# Altium project Actuator Controller.PrjPcb
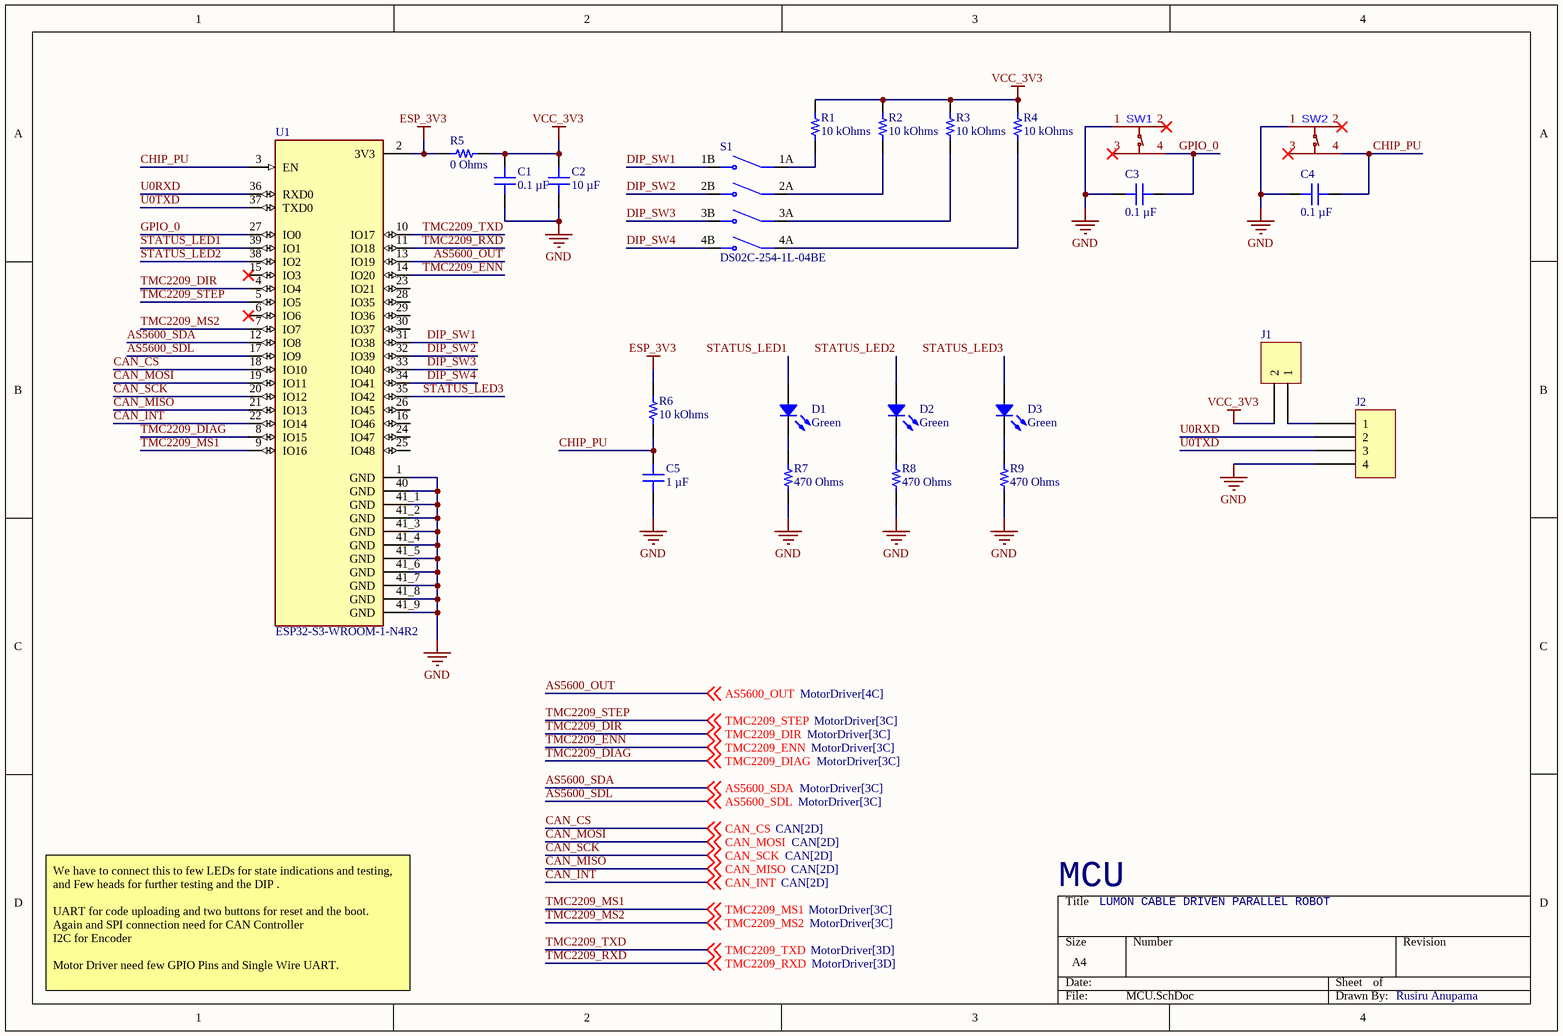
[diagram p0: MCU.SchDoc]
4 sheets, 63 parts. Net scope: global (net labels, ports and power ports of the same name join across sheets).
Board file: AcutuatorPCB.PcbDoc
Sheets:
  MCU.SchDoc
  Power.SchDoc
  MotorDriver.SchDoc
  CAN.SchDoc

## Sheet MCU.SchDoc
size A4; SheetNumber: 1; SheetTotal: 4

### Parts
C1  0.1 µF  [CAP 0805_2012]
C2  10 µF  [CAP 0805_2012]
C3  0.1 µF  [CAP 0805_2012]
C4  0.1 µF  [CAP 0805_2012]
C5  1 µF  [CAP 0805_2012]
D1  Green  [LED 0805_2012 GREEN]
D2  Green  [LED 0805_2012 GREEN]
D3  Green  [LED 0805_2012 GREEN]
J1  0022272021  [MOLEX KK 0022272021]  (value not drawn)
J2  0022272041  [MOLEX KK 0022272041]  (value not drawn)
R1  10 kOhms  [RES 0805_2012]
R2  10 kOhms  [RES 0805_2012]
R3  10 kOhms  [RES 0805_2012]
R4  10 kOhms  [RES 0805_2012]
R5  0 Ohms  [RES 0805_2012]
R6  10 kOhms  [RES 0805_2012]
R7  470 Ohms  [RES 0805_2012]
R8  470 Ohms  [RES 0805_2012]
R9  470 Ohms  [RES 0805_2012]
S1  DS02C-254-1L-04BE  [SW_DS02C-254-1L-04BE]
SW1  4.5X4.5X5.0WATERPROOF TACT SWITCH DIP 260G  [SW-TH_4P-L4.5-W4.5-P3.00-LS5.5]  (value not drawn)
SW2  4.5X4.5X5.0WATERPROOF TACT SWITCH DIP 260G  [SW-TH_4P-L4.5-W4.5-P3.00-LS5.5]  (value not drawn)
U1  ESP32-S3-WROOM-1-N4R2  [XCVR_ESP32-S3-WROOM-1-N4R2]

### Nets
ESP_3V3: R5.1 R6.2 U1.2(3V3)
GND: C1.1 C2.1 C3.1 C4.1 C5.1 J2.4 R7.1 R8.1 R9.1 SW1.1(A) SW2.1(A) U1.1(GND) U1.40(GND) U1.41_1(GND) U1.41_2(GND) U1.41_3(GND) U1.41_4(GND) U1.41_5(GND) U1.41_6(GND) U1.41_7(GND) U1.41_8(GND) U1.41_9(GND)
VCC_3V3: C1.2 C2.2 J1.2 R1.2 R2.2 R3.2 R4.2 R5.2
AS5600_OUT: U1.13(IO19) ; off-sheet AS5600_OUT
AS5600_SDA: U1.12(IO8) ; off-sheet AS5600_SDA
AS5600_SDL: U1.17(IO9) ; off-sheet AS5600_SDL
CAN_CS: U1.18(IO10) ; off-sheet CAN_CS
CAN_INT: U1.22(IO14) ; off-sheet CAN_INT
CAN_MISO: U1.21(IO13) ; off-sheet CAN_MISO
CAN_MOSI: U1.19(IO11) ; off-sheet CAN_MOSI
CAN_SCK: U1.20(IO12) ; off-sheet CAN_SCK
CHIP_PU: C4.2 C5.2 R6.1 SW2.4(D) U1.3(EN)
DIP_SW1: S1.1B(NO1) U1.31(IO38)
DIP_SW2: S1.2B(NO2) U1.32(IO39)
DIP_SW3: S1.3B(NO3) U1.33(IO40)
DIP_SW4: S1.4B(NO4) U1.34(IO41)
GPIO_0: C3.2 SW1.4(D) U1.27(IO0)
STATUS_LED1: D1.1 U1.39(IO1)
STATUS_LED2: D2.1 U1.38(IO2)
STATUS_LED3: D3.1 U1.35(IO42)
TMC2209_DIAG: U1.8(IO15) ; off-sheet TMC2209_DIAG
TMC2209_DIR: U1.4(IO4) ; off-sheet TMC2209_DIR
TMC2209_ENN: U1.14(IO20) ; off-sheet TMC2209_ENN
TMC2209_MS1: U1.9(IO16) ; off-sheet TMC2209_MS1
TMC2209_MS2: U1.7(IO7) ; off-sheet TMC2209_MS2
TMC2209_RXD: U1.11(IO18) ; off-sheet TMC2209_RXD  [project net PD_UART]
TMC2209_STEP: U1.5(IO5) ; off-sheet TMC2209_STEP
TMC2209_TXD: U1.10(IO17) ; off-sheet TMC2209_TXD
U0RXD: J2.2 U1.36(RXD0)
U0TXD: J2.3 U1.37(TXD0)
NetD1_2: D1.2 R7.2
NetD2_2: D2.2 R8.2
NetD3_2: D3.2 R9.2
NetJ1_1: J1.1 J2.1
NetR1_1: R1.1 S1.1A(COM1)
NetR2_1: R2.1 S1.2A(COM2)
NetR3_1: R3.1 S1.3A(COM3)
NetR4_1: R4.1 S1.4A(COM4)

Not connected (* = marked no-connect by the designer): SW1 2(B)* 3(C)*; SW2 2(B)* 3(C)*; U1 6(IO6)* 15(IO3)* 16(IO46) 23(IO21) 24(IO47) 25(IO48) 26(IO45) 28(IO35) 29(IO36) 30(IO37)

### Notes on the sheet
- MCU
- LUMON CABLE DRIVEN PARALLEL ROBOT
- We have to connect this to few LEDs for state indications and testing, and Few heads for further testing and the DIP .
  UART for code uploading and two buttons for reset and the boot.
  Again and SPI connection need for CAN Controller
  I2C for Encoder
  Motor Driver need few GPIO Pins and Single Wire UART.
- Rusiru Anupama

### Library data of the parts
C1 C3 C4 = CC0805MRX7R9BB104: CAP CER 0.1UF 50V X7R 0805; manufacturer: Yageo; Tolerance: ±20%; Part Number: CC0805MRX7R9BB104; Capacitance: 0.1 µF; Applications: General Purpose; componentlink1description: Datasheet; componentlink1url: https://www.yageo.com/upload/media/product/productsearch/datasheet/mlcc/UPY-GPHC_X7R_6.3V-to-50V_18.pdf; componentlink2description: DigiKey Link; componentlink2url: https://www.digikey.com/en/products/detail/yageo/CC0805MRX7R9BB104/5884281; Device Package: 0805 (2012 Metric); lastupdated: 4/6/2026 7:33:19 PM; Lifecycle Status: Active; Minimum Order: 1; Mounting Type: Surface Mount, MLCC; Operating Temperature: -55°C ~ 125°C; Package / Case: 0805 (2012 Metric); packaging: TapeAndReel; partid: 2475; Part Status: Active; price: 0.01; series: CC; Size / Dimension: 0.079" L x 0.049" W (2.00mm x 1.25mm); Supplier 1: DigiKey; Supplier Part Number 1: 311-4351-1-ND; Temperature Coefficient: X7R; Thickness (Max): 0.037" (0.95mm); value: 0.1 µF; Voltage - Rated: 50V; LCSC part #: C49678
  C1 C3: Parameter 1: *
C2 = CL21Y106KPQVPNE: CAP CER 10UF 10V X7S 0805; manufacturer: Samsung Electro-Mechanics; Tolerance: ±10%; Part Number: CL21Y106KPQVPNE; Capacitance: 10 µF; Applications: Automotive; componentlink1description: Datasheet; componentlink1url: http://www.samsungsem.com/kr/support/product-search/mlcc/CL21Y106KPQVPNE.jsp; componentlink2description: DigiKey Link; componentlink2url: https://www.digikey.com/en/products/detail/samsung-electro-mechanics/CL21Y106KPQVPNE/5961169; Device Package: 0805 (2012 Metric); Features: General Purpose; lastupdated: 4/6/2026 7:33:17 PM; Lifecycle Status: Active; Minimum Order: 1; Mounting Type: Surface Mount, MLCC, Epoxy; Operating Temperature: -55°C ~ 125°C; Package / Case: 0805 (2012 Metric); packaging: TapeAndReel; partid: 2979; Part Status: Active; price: 0.06; Ratings: AEC-Q200; series: CL; Size / Dimension: 0.079" L x 0.049" W (2.00mm x 1.25mm); Supplier 1: DigiKey; Supplier Part Number 1: 1276-6685-1-ND; Temperature Coefficient: X7S; Thickness (Max): 0.055" (1.40mm); value: 10 µF; Voltage - Rated: 10V; LCSC part #: C32635
C5 = C2012X8R1C105K125AB: CAP CER 1UF 16V X8R 0805; manufacturer: TDK Corporation; Tolerance: ±10%; Part Number: C2012X8R1C105K125AB; Capacitance: 1 µF; Applications: General Purpose; componentlink1description: Datasheet; componentlink1url: https://product.tdk.com/info/en/catalog/datasheets/mlcc_commercial_hightemp_en.pdf?ref_disty=digikey; componentlink2description: DigiKey Link; componentlink2url: https://www.digikey.com/en/products/detail/tdk-corporation/C2012X8R1C105K125AB/3248171; Device Package: 0805 (2012 Metric); Features: High Temperature; lastupdated: 4/6/2026 7:33:17 PM; Lifecycle Status: Active; Minimum Order: 1; Mounting Type: Surface Mount, MLCC; Operating Temperature: -55°C ~ 150°C; Package / Case: 0805 (2012 Metric); packaging: TapeAndReel; partid: 2997; Part Status: Active; price: 0.07; series: C; Size / Dimension: 0.079" L x 0.049" W (2.00mm x 1.25mm); Supplier 1: DigiKey; Supplier Part Number 1: 445-8829-1-ND; Temperature Coefficient: X8R; Thickness (Max): 0.057" (1.45mm); value: 1 µF; Voltage - Rated: 16V; LCSC part #: C24123
D1-D3 = 5975316507F: LED GREEN 0805 SMD; Manufacturer: Dialight; Configuration: Standard; Current - Test: 20mA; Lens Color: 0.93mm; Lens Size: 1.40mm x 1.24mm; Lens Style: Rectangle with Flat Top; Millicandela Rating: 16mcd; Voltage - Forward (Vf) (Typ): 2.2V; Wavelength - Dominant: 560nm; Part Number: 5975316507F; Color: Green; ComponentLink1Description: Datasheet; ComponentLink1URL: http://www.dialightsignalsandcomponents.com/Assets/Drawings/2D_Drawings_DrawingDetailedSpec/NewDrawings/18370A.pdf; ComponentLink2Description: DigiKey Link; ComponentLink2URL: https://www.digikey.com/en/products/detail/dialight/5975316507F/9385444; Device Package: 0805 (2012 Metric); Height (Max): 0.93mm; LastUpdated: 4/5/2026 8:39:04 PM; Lifecycle Status: Active; Minimum Order: 1; Mounting Type: Surface Mount; Package / Case: 0805 (2012 Metric); Packaging: TapeAndReel; PartId: 245; Part Status: Active; Price: 0.14; Series: 597; Size / Dimension: 2.00mm L x 1.25mm W; Supplier 1: DigiKey; Supplier Part Number 1: 350-4389-1-ND; Supplier Device Package: 0805; Value: Green; LCSC part #: C84260
J1 = 0022272021: CONN HEADER VERT 2POS 2.54MM; Manufacturer: Molex; Contact Length - Mating: 0.295" (7.49mm); Contact Length - Post: 0.140" (3.56mm); Material Flammability Rating: UL94 V-0; Number of Positions: 2; Number of Positions Loaded: All; Overall Contact Length: 0.560" (14.22mm); Pitch - Mating: 0.100" (2.54mm); Shrouding: Shrouded - 1 Wall; Style: Board to Cable/Wire; Part Number: 0022272021; ComponentLink1Description: Datasheet; ComponentLink1URL: https://www.molex.com/pdm_docs/sd/022272021_sd.pdf; ComponentLink2Description: DigiKey Link; ComponentLink2URL: http://digikey.com/product-detail/en/molex/0022272021/WM4111-ND/1130577; Connector Type: Header; Contact Finish - Mating: Tin; Contact Finish - Post: Tin; Contact Finish Thickness - Mating: 100.0µin (2.54µm); Contact Material: Brass; Contact Shape: Square; Contact Type: Male Pin; Fastening Type: Friction Lock; Insulation Color: Natural; Insulation Height: 0.461" (11.70mm); Insulation Material: Polyamide (PA), Nylon; LastUpdated: 1/12/2020 11:51:43 PM; Lifecycle Status: Active; Minimum Order: 1; Mounting Type: Through Hole; Number of Rows: 1; Packaging: Bulk; PartId: 76; Part Status: Active; Price: 0.27; Series: KK 6410; Supplier 1: DigiKey; Supplier Part Number 1: WM4111-ND; Termination: Solder
J2 = 0022272041: CONN HEADER VERT 4POS 2.54MM; Manufacturer: Molex; Contact Length - Mating: 0.295" (7.49mm); Contact Length - Post: 0.140" (3.56mm); Material Flammability Rating: UL94 V-0; Number of Positions: 4; Number of Positions Loaded: All; Overall Contact Length: 0.560" (14.22mm); Pitch - Mating: 0.100" (2.54mm); Shrouding: Shrouded - 1 Wall; Style: Board to Cable/Wire; Part Number: 0022272041; ComponentLink1Description: Datasheet; ComponentLink1URL: https://www.molex.com/pdm_docs/sd/022272041_sd.pdf; ComponentLink2Description: DigiKey Link; ComponentLink2URL: http://digikey.com/product-detail/en/molex/0022272041/WM4113-ND/1130579; Connector Type: Header; Contact Finish - Mating: Tin; Contact Finish - Post: Tin; Contact Finish Thickness - Mating: 100.0µin (2.54µm); Contact Material: Brass; Contact Shape: Square; Contact Type: Male Pin; Fastening Type: Friction Lock; Insulation Color: Natural; Insulation Height: 0.461" (11.70mm); Insulation Material: Polyamide (PA), Nylon; LastUpdated: 1/12/2020 11:52:05 PM; Lifecycle Status: Active; Minimum Order: 1; Mounting Type: Through Hole; Number of Rows: 1; Packaging: Bulk; PartId: 78; Part Status: Active; Price: 0.40; Series: KK 6410; Supplier 1: DigiKey; Supplier Part Number 1: WM4113-ND; Termination: Solder
R1-R4 R6 = CPF0805B10KE: RES SMD 10K OHM 0.1% 1/10W 0805; Manufacturer: TE Connectivity Passive Product; Power (Watts): 0.1W, 1/10W; Temperature Coefficient: ±25ppm/°C; Part Number: CPF0805B10KE; Value: 10 kOhms; ComponentLink1Description: Datasheet; ComponentLink1URL: https://www.te.com/commerce/DocumentDelivery/DDEController?Action=srchrtrv&DocNm=1773200&DocType=DS&DocLang=English; ComponentLink2Description: DigiKey Link; ComponentLink2URL: https://www.digikey.com/en/products/detail/te-connectivity-passive-product/CPF0805B10KE/2389790; Composition: Thin Film; Device Package: 0805 (2012 Metric); Height - Seated (Max): 0.026" (0.65mm); LastUpdated: 4/5/2026 8:11:26 PM; Lifecycle Status: Active; Minimum Order: 1; Number of Terminations: 2; Operating Temperature: -55°C ~ 155°C; Package / Case: 0805 (2012 Metric); Packaging: TapeAndReel; PartId: 27724; Part Status: Active; Price: 0.09; Resistance: 10 kOhms; Series: CPF, Neohm; Size / Dimension: 0.079" L x 0.049" W (2.00mm x 1.25mm); Supplier 1: DigiKey; Supplier Part Number 1: A106043CT-ND; Supplier Device Package: 0805; Tolerance: ±0.1%; LCSC part #: C84376
R5 = TLRZ2ATTD: RES 0 OHM JUMPER 0805; Manufacturer: KOA Speer Electronics, Inc.; Part Number: TLRZ2ATTD; Value: 0 Ohms; ComponentLink1Description: Datasheet; ComponentLink1URL: http://www.koaspeer.com/catimages/Products/TLRZ/TLRZ.pdf; ComponentLink2Description: DigiKey Link; ComponentLink2URL: https://www.digikey.com/en/products/detail/koa-speer-electronics-inc/TLRZ2ATTD/9845494; Composition: Metal Element; Device Package: 0805 (2012 Metric); Features: Automotive AEC-Q200, Current Sense; Height - Seated (Max): 0.022" (0.55mm); LastUpdated: 4/5/2026 8:11:26 PM; Lifecycle Status: Active; Minimum Order: 1; Number of Terminations: 2; Operating Temperature: -65°C ~ 170°C; Package / Case: 0805 (2012 Metric); Packaging: TapeAndReel; PartId: 27685; Part Status: Active; Price: 0.08; Ratings: AEC-Q200; Resistance: 0 Ohms; Series: TLRZ; Size / Dimension: 0.079" L x 0.049" W (2.00mm x 1.25mm); Supplier 1: DigiKey; Supplier Part Number 1: 2019-TLRZ2ATTDCT-ND; Supplier Device Package: 0805; Tolerance: Jumper
R7-R9 = ERJ-PB6B4700V: RES SMD 470 OHM 0.1% 1/4W 0805; Manufacturer: Panasonic Electronic Components; Power (Watts): 0.25W, 1/4W; Temperature Coefficient: ±50ppm/°C; Part Number: ERJ-PB6B4700V; Value: 470 Ohms; ComponentLink1Description: Datasheet; ComponentLink1URL: https://industrial.panasonic.com/cdbs/www-data/pdf/RDM0000/AOA0000C328.pdf; ComponentLink2Description: DigiKey Link; ComponentLink2URL: https://www.digikey.com/en/products/detail/panasonic-electronic-components/ERJ-PB6B4700V/6213339; Composition: Thick Film; Device Package: 0805 (2012 Metric); Features: Automotive AEC-Q200; Height - Seated (Max): 0.028" (0.70mm); LastUpdated: 4/5/2026 8:11:23 PM; Lifecycle Status: Active; Minimum Order: 1; Number of Terminations: 2; Operating Temperature: -55°C ~ 155°C; Package / Case: 0805 (2012 Metric); Packaging: TapeAndReel; PartId: 28402; Part Status: Active; Price: 0.04; Ratings: AEC-Q200; Resistance: 470 Ohms; Series: ERJ-PB6; Size / Dimension: 0.079" L x 0.049" W (2.00mm x 1.25mm); Supplier 1: DigiKey; Supplier Part Number 1: P20556CT-ND; Supplier Device Package: 0805; Tolerance: ±0.1%; LCSC part #: C441978
S1 = DS02C-254-1L-04BE: 4 Position, Through Hole, 2.54 mm Pitch, Raised Piano Slide Actuator, Convex Bottom, Long Pin, DIP Switch; MF: Same Sky; SnapEDA_Link: https://www.snapeda.com/parts/DS02C-254-1L-04BE/Same+Sky/view-part/?ref=snap; Package: None; Value: *; MP: DS02C-254-1L-04BE; Check_prices: https://www.snapeda.com/parts/DS02C-254-1L-04BE/Same+Sky/view-part/?ref=eda; LCSC part #: C5123702
U1 = ESP32-S3-WROOM-1-N4R2: Bluetooth, WiFi 802.11b/g/n, Bluetooth v5.0 Transceiver Module 2.4GHz PCB Trace Surface Mount; MF: Espressif Systems; Package: None; Purchase-URL: https://pricing.snapeda.com/search/part/ESP32-S3-WROOM-1-N4R2/?ref=eda; Price: None; Availability: In Stock; Check_prices: https://www.snapeda.com/parts/ESP32-S3-WROOM-1-N4R2/Espressif+Systems/view-part/?ref=eda; MP: ESP32-S3-WROOM-1-N4R2; SnapEDA_Link: https://www.snapeda.com/parts/ESP32-S3-WROOM-1-N4R2/Espressif+Systems/view-part/?ref=snap; Value: *; LCSC part #: C82899
SW1 SW2 = 4.5X4.5X5.0WATERPROOF TACT SWITCH DIP 260G: LCSC part #: C39832249

## Sheet Power.SchDoc
size A; SheetNumber: 2; SheetTotal: 4
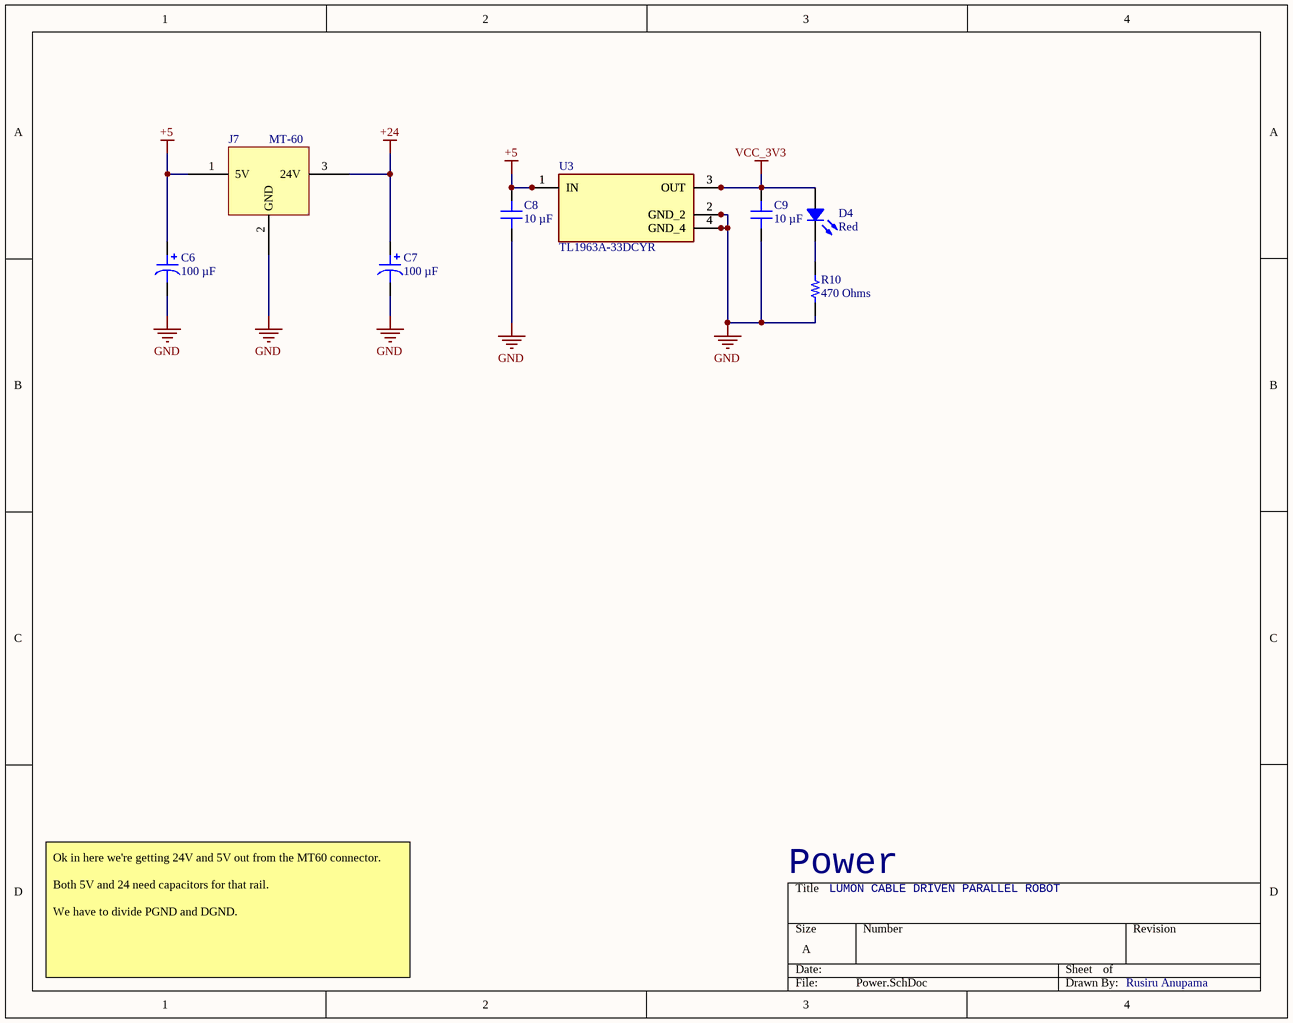
[diagram p1: Power.SchDoc]

### Parts
C6  100 µF  [CAP ALSMD 8.3MM H10.5MM]
C7  100 µF  [CAP ALSMD 8.3MM H10.5MM]
C8  10 µF  [CAP 0805_2012]
C9  10 µF  [CAP 0805_2012]
D4  Red  [LED 0805_2012 RED]
J7  MT-60  [MT-60]
R10  470 Ohms  [RES 0805_2012]
U3  TL1963A-33DCYR  [VREG_TL1963A-33DCYR]

### Nets
+5: C6.1 C8.2 J7.1(5V) U3.1(IN)
+24: C7.1 J7.3(24V)  [project net VS]
GND: C6.2 C7.2 C8.1 C9.1 J7.2(GND) R10.1 U3.2(GND_2) U3.4(GND_4)
VCC_3V3: C9.2 D4.1 U3.3(OUT)
NetD4_2: D4.2 R10.2

### Notes on the sheet
- Power
- LUMON CABLE DRIVEN PARALLEL ROBOT
- Ok in here we're getting 24V and 5V out from the MT60 connector.
  Both 5V and 24 need capacitors for that rail.
  We have to divide PGND and DGND.
- Rusiru Anupama

### Library data of the parts
C6 C7 = 50SKV100M8X10.5: CAP ALUM 100UF 20% 50V SMD; manufacturer: Rubycon; Lifetime @ Temp.: 1000 Hrs @ 105°C; Polarization: Polar; Ripple Current @ High Frequency: 240 mA @ 10 kHz; Ripple Current @ Low Frequency: 200 mA @ 120 Hz; Surface Mount Land Size: 0.327" L x 0.327" W (8.30mm x 8.30mm); Part Number: 50SKV100M8X10.5; Applications: General Purpose; Capacitance: 100 µF; componentlink1description: Datasheet; componentlink1url: http://www.rubycon.co.jp/en/catalog/e_pdfs/aluminum/e_SKV.pdf; componentlink2description: DigiKey Link; componentlink2url: https://www.digikey.com/en/products/detail/rubycon/50SKV100M8X10-5/3568726; Device Package: Radial, Can - SMD; Height - Seated (Max): 0.413" (10.50mm); lastupdated: 4/5/2026 8:53:56 PM; Lifecycle Status: Active; Minimum Order: 1; Mounting Type: Surface Mount; Operating Temperature: -55°C ~ 105°C; Package / Case: Radial, Can - SMD; packaging: TapeAndReel; partid: 7600; Part Status: Active; price: 0.17; series: SKV; Size / Dimension: 0.315" Dia (8.00mm); Supplier 1: DigiKey; Supplier Part Number 1: 1189-3108-1-ND; Tolerance: ±20%; value: 100 µF; Voltage - Rated: 50 V; LCSC part #: C2983550
C8 C9 = CL21Y106KPQVPNE: as C2 on sheet MCU; Part Number: CL21Y106KPQVPNE; Capacitance: 10 µF; Applications: Automotive; componentlink1description: Datasheet; componentlink1url: http://www.samsungsem.com/kr/support/product-search/mlcc/CL21Y106KPQVPNE.jsp; componentlink2description: DigiKey Link; componentlink2url: https://www.digikey.com/en/products/detail/samsung-electro-mechanics/CL21Y106KPQVPNE/5961169; Device Package: 0805 (2012 Metric); Features: General Purpose; lastupdated: 4/6/2026 7:33:17 PM; Lifecycle Status: Active; Minimum Order: 1; Mounting Type: Surface Mount, MLCC, Epoxy; Operating Temperature: -55°C ~ 125°C; Package / Case: 0805 (2012 Metric); packaging: TapeAndReel; partid: 2979; Part Status: Active; price: 0.06; Ratings: AEC-Q200; series: CL; Size / Dimension: 0.079" L x 0.049" W (2.00mm x 1.25mm); Supplier 1: DigiKey; Supplier Part Number 1: 1276-6685-1-ND; Temperature Coefficient: X7S; Thickness (Max): 0.055" (1.40mm); value: 10 µF; Voltage - Rated: 10V; LCSC part #: C32635
D4 = 5990110007F: LED RED 0805 SMD; Manufacturer: Dialight; Configuration: Standard; Current - Test: 20mA; Lens Color: 0.80mm; Lens Size: 1.40mm x 1.25mm; Lens Style: Rectangle with Flat Top; Millicandela Rating: 29mcd; Viewing Angle: 140°; Voltage - Forward (Vf) (Typ): 2.1V; Wavelength - Dominant: 633nm; Part Number: 5990110007F; Color: Red; ComponentLink1Description: Datasheet; ComponentLink1URL: http://www.dialightsignalsandcomponents.com/Assets/Brochures_And_Catalogs/Indication/CBI_SMD_new/Dialight_CBI_data_599-0805_Apr2018.pdf; ComponentLink2Description: DigiKey Link; ComponentLink2URL: https://www.digikey.com/en/products/detail/dialight/5990110007F/9385408; Device Package: 0805 (2012 Metric); Height (Max): 0.80mm; LastUpdated: 4/5/2026 8:38:27 PM; Lifecycle Status: Active; Minimum Order: 1; Mounting Type: Surface Mount; Package / Case: 0805 (2012 Metric); Packaging: TapeAndReel; PartId: 308; Part Status: Active; Price: 0.04; Series: 599; Size / Dimension: 2.00mm L x 1.25mm W; Supplier 1: DigiKey; Supplier Part Number 1: 350-4353-1-ND; Supplier Device Package: 0805; Value: Red; LCSC part #: C19171391
R10 = ERJ-PB6B4700V: as R7 on sheet MCU; Part Number: ERJ-PB6B4700V; Value: 470 Ohms; ComponentLink1Description: Datasheet; ComponentLink1URL: https://industrial.panasonic.com/cdbs/www-data/pdf/RDM0000/AOA0000C328.pdf; ComponentLink2Description: DigiKey Link; ComponentLink2URL: https://www.digikey.com/en/products/detail/panasonic-electronic-components/ERJ-PB6B4700V/6213339; Composition: Thick Film; Device Package: 0805 (2012 Metric); Features: Automotive AEC-Q200; Height - Seated (Max): 0.028" (0.70mm); LastUpdated: 4/5/2026 8:11:23 PM; Lifecycle Status: Active; Minimum Order: 1; Number of Terminations: 2; Operating Temperature: -55°C ~ 155°C; Package / Case: 0805 (2012 Metric); Packaging: TapeAndReel; PartId: 28402; Part Status: Active; Price: 0.04; Ratings: AEC-Q200; Resistance: 470 Ohms; Series: ERJ-PB6; Size / Dimension: 0.079" L x 0.049" W (2.00mm x 1.25mm); Supplier 1: DigiKey; Supplier Part Number 1: P20556CT-ND; Supplier Device Package: 0805; Tolerance: ±0.1%; LCSC part #: C441978
U3 = TL1963A-33DCYR: 1.5-A, 20-V, low-dropout voltage regulator with reverse current & reverse voltage protection; MF: Texas Instruments; SnapEDA_Link: https://www.snapeda.com/parts/TL1963A-33DCYR/Texas+Instruments/view-part/?ref=snap; Package: SOT-223-4 Texas Instruments; Value: *; MP: TL1963A-33DCYR; Check_prices: https://www.snapeda.com/parts/TL1963A-33DCYR/Texas+Instruments/view-part/?ref=eda; LCSC part #: C181262
J7 = MT-60: LCSC part #: C99176

## Sheet MotorDriver.SchDoc
size A; SheetNumber: 3; SheetTotal: 4
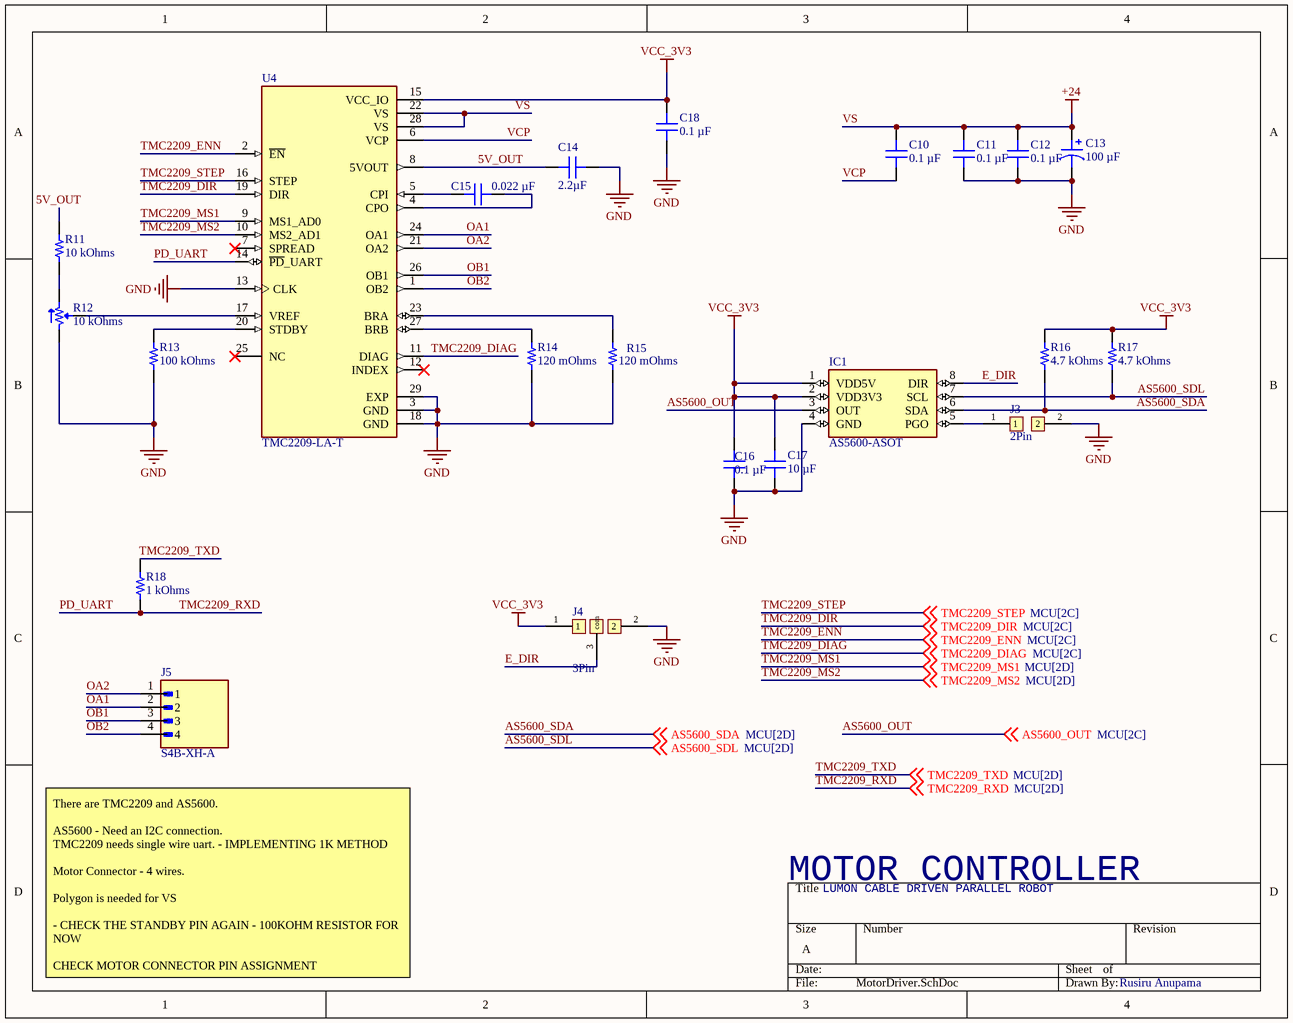
[diagram p2: MotorDriver.SchDoc]

### Parts
C10  0.1 µF  [CAP 0805_2012]
C11  0.1 µF  [CAP 0805_2012]
C12  0.1 µF  [CAP 0805_2012]
C13  100 µF  [CAP ALSMD 8.3MM H10.5MM]
C14  2.2µF  [CAP 0805_2012]
C15  0.022 µF  [CAP 0805_2012]
C16  0.1 µF  [CAP 0805_2012]
C17  10 µF  [CAP 0805_2012]
C18  0.1 µF  [CAP 0805_2012]
IC1  AS5600-ASOT  [SOIC127P600X175-8N]
J3  2Pin  [2Pin]
J4  3Pin  [Solder_Bridge]
J5  S4B-XH-A  [JST_S4B-XH-A]
R11  10 kOhms  [RES 0805_2012]
R12  10 kOhms  [POT BOURNS TRIMPOT TC33]
R13  100 kOhms  [RES 0805_2012]
R14  120 mOhms  [RES 1206_3216]
R15  120 mOhms  [RES 1206_3216]
R16  4.7 kOhms  [RES 0805_2012]
R17  4.7 kOhms  [RES 0805_2012]
R18  1 kOhms  [RES 0805_2012]
U4  TMC2209-LA-T  [QFN50P500X500X90-29N]

### Nets
GND: C11.1 C12.1 C13.2 C14.2 C16.1 C17.1 C18.1 IC1.4(GND) J3.2 J4.2 R12.1 R13.1 R14.1 R15.1 U4.3(GND) U4.13(CLK) U4.18(GND) U4.29(EXP)
VCC_3V3: C16.2 C17.2 C18.2 IC1.1(VDD5V) IC1.2(VDD3V3) J4.1 R16.2 R17.2 U4.15(VCC_IO)
VS: C10.1 C11.2 C12.2 C13.1 U4.22(VS) U4.28(VS)  [also labelled +24]
5V_OUT: C14.1 R11.2 U4.8(5VOUT)
AS5600_OUT: IC1.3(OUT) ; off-sheet AS5600_OUT
AS5600_SDA: IC1.6(SDA) R16.1 ; off-sheet AS5600_SDA
AS5600_SDL: IC1.7(SCL) R17.1 ; off-sheet AS5600_SDL
E_DIR: IC1.8(DIR) J4.3(com)
OA1: J5.2 U4.24(OA1)
OA2: J5.1 U4.21(OA2)
OB1: J5.3 U4.26(OB1)
OB2: J5.4 U4.1(OB2)
PD_UART: R18.1 U4.14(~{PD}_UART) ; off-sheet TMC2209_RXD  [also labelled TMC2209_RXD]
TMC2209_DIAG: U4.11(DIAG) ; off-sheet TMC2209_DIAG
TMC2209_DIR: U4.19(DIR) ; off-sheet TMC2209_DIR
TMC2209_ENN: U4.2(~{EN}) ; off-sheet TMC2209_ENN
TMC2209_MS1: U4.9(MS1_AD0) ; off-sheet TMC2209_MS1
TMC2209_MS2: U4.10(MS2_AD1) ; off-sheet TMC2209_MS2
TMC2209_STEP: U4.16(STEP) ; off-sheet TMC2209_STEP
TMC2209_TXD: R18.2 ; off-sheet TMC2209_TXD
VCP: C10.2 U4.6(VCP)
NetC15_1: C15.1 U4.4(CPO)
NetC15_2: C15.2 U4.5(CPI)
NetIC1_5: IC1.5(PGO) J3.1
NetR11_1: R11.1 R12.3
NetR12_2: R12.2 U4.17(VREF)
NetR13_2: R13.2 U4.20(STDBY)
NetR14_2: R14.2 U4.27(BRB)
NetR15_2: R15.2 U4.23(BRA)

Not connected (* = marked no-connect by the designer): U4 7(SPREAD)* 12(INDEX)* 25(NC)*

### Notes on the sheet
- MOTOR CONTROLLER
- LUMON CABLE DRIVEN PARALLEL ROBOT
- There are TMC2209 and AS5600.
  AS5600 - Need an I2C connection.
  TMC2209 needs single wire uart. - IMPLEMENTING 1K METHOD
  Motor Connector - 4 wires.
  Polygon is needed for VS
  - CHECK THE STANDBY PIN AGAIN - 100KOHM RESISTOR FOR NOW
  CHECK MOTOR CONNECTOR PIN ASSIGNMENT
- Rusiru Anupama

### Library data of the parts
C10-C12 C16 C18 = CC0805MRX7R9BB104: as C1 on sheet MCU; Part Number: CC0805MRX7R9BB104; Capacitance: 0.1 µF; Applications: General Purpose; componentlink1description: Datasheet; componentlink1url: https://www.yageo.com/upload/media/product/productsearch/datasheet/mlcc/UPY-GPHC_X7R_6.3V-to-50V_18.pdf; componentlink2description: DigiKey Link; componentlink2url: https://www.digikey.com/en/products/detail/yageo/CC0805MRX7R9BB104/5884281; Device Package: 0805 (2012 Metric); lastupdated: 4/6/2026 7:33:19 PM; Lifecycle Status: Active; Minimum Order: 1; Mounting Type: Surface Mount, MLCC; Operating Temperature: -55°C ~ 125°C; Package / Case: 0805 (2012 Metric); packaging: TapeAndReel; partid: 2475; Part Status: Active; price: 0.01; series: CC; Size / Dimension: 0.079" L x 0.049" W (2.00mm x 1.25mm); Supplier 1: DigiKey; Supplier Part Number 1: 311-4351-1-ND; Temperature Coefficient: X7R; Thickness (Max): 0.037" (0.95mm); value: 0.1 µF; Voltage - Rated: 50V; LCSC part #: C49678
C13 = 50SKV100M8X10.5: as C6 on sheet Power; Part Number: 50SKV100M8X10.5; Applications: General Purpose; Capacitance: 100 µF; componentlink1description: Datasheet; componentlink1url: http://www.rubycon.co.jp/en/catalog/e_pdfs/aluminum/e_SKV.pdf; componentlink2description: DigiKey Link; componentlink2url: https://www.digikey.com/en/products/detail/rubycon/50SKV100M8X10-5/3568726; Device Package: Radial, Can - SMD; Height - Seated (Max): 0.413" (10.50mm); lastupdated: 4/5/2026 8:53:56 PM; Lifecycle Status: Active; Minimum Order: 1; Mounting Type: Surface Mount; Operating Temperature: -55°C ~ 105°C; Package / Case: Radial, Can - SMD; packaging: TapeAndReel; partid: 7600; Part Status: Active; price: 0.17; series: SKV; Size / Dimension: 0.315" Dia (8.00mm); Supplier 1: DigiKey; Supplier Part Number 1: 1189-3108-1-ND; Tolerance: ±20%; value: 100 µF; Voltage - Rated: 50 V; LCSC part #: C2983550
C14 = 0805YD225KAT2A: CAP CER 2.2UF 16V X5R 0805; manufacturer: AVX Corporation; Tolerance: ±10%; Part Number: 0805YD225KAT2A; Capacitance: 2.2µF; Applications: General Purpose; componentlink1description: Datasheet; componentlink1url: http://datasheets.avx.com/cx5r.pdf; componentlink2description: DigiKey Link; componentlink2url: http://digikey.com/product-detail/en/avx-corporation/0805YD225KAT2A/478-2580-1-ND/717525; Device Package: 0805 (2012 Metric); lastupdated: 9/2/2020 1:04:40 AM; Lifecycle Status: Active; Minimum Order: 1; Mounting Type: Surface Mount, MLCC; Operating Temperature: -55°C ~ 85°C; Package / Case: 0805 (2012 Metric); packaging: TapeAndReel; partid: 3362; Part Status: Active; price: 0.16; series: -; Size / Dimension: 0.079" L x 0.049" W (2.01mm x 1.25mm); Supplier 1: DigiKey; Supplier Part Number 1: 478-2580-1-ND; Temperature Coefficient: X5R; Thickness (Max): 0.055" (1.40mm); value: 2.2µF; Voltage - Rated: 16V; LCSC part #: C377773
C15 = C0805X223K5REC7210: CAP CER 0805 22NF 50V X7R 10%; manufacturer: KEMET; Part Number: C0805X223K5REC7210; Capacitance: 0.022 µF; Applications: Boardflex Sensitive, ESD Protection; componentlink1description: Datasheet; componentlink1url: https://api.kemet.com/component-edge/download/datasheet/C0805X223K5REC7210.pdf; componentlink2description: DigiKey Link; componentlink2url: https://www.digikey.com/en/products/detail/kemet/C0805X223K5REC7210/8652064; Device Package: 0805 (2012 Metric); Features: Soft Termination; lastupdated: 4/6/2026 7:31:59 PM; Lifecycle Status: Active; Minimum Order: 1; Mounting Type: Surface Mount, MLCC; Operating Temperature: -55°C ~ 125°C; Package / Case: 0805 (2012 Metric); packaging: TapeAndReel; partid: 32185; Part Status: Active; price: 0.05; series: ESD SMD Comm X7R; Size / Dimension: 0.079" L x 0.049" W (2.00mm x 1.25mm); Supplier 1: DigiKey; Supplier Part Number 1: 399-C0805X223K5REC7210CT-ND; Temperature Coefficient: X7R; Thickness (Max): 0.039" (0.98mm); Tolerance: ±10%; value: 0.022 µF; Voltage - Rated: 50V; LCSC part #: C77069
C17 = CL21Y106KPQVPNE: as C2 on sheet MCU; Part Number: CL21Y106KPQVPNE; Capacitance: 10 µF; Applications: Automotive; componentlink1description: Datasheet; componentlink1url: http://www.samsungsem.com/kr/support/product-search/mlcc/CL21Y106KPQVPNE.jsp; componentlink2description: DigiKey Link; componentlink2url: https://www.digikey.com/en/products/detail/samsung-electro-mechanics/CL21Y106KPQVPNE/5961169; Device Package: 0805 (2012 Metric); Features: General Purpose; lastupdated: 4/6/2026 7:33:17 PM; Lifecycle Status: Active; Minimum Order: 1; Mounting Type: Surface Mount, MLCC, Epoxy; Operating Temperature: -55°C ~ 125°C; Package / Case: 0805 (2012 Metric); packaging: TapeAndReel; partid: 2979; Part Status: Active; price: 0.06; Ratings: AEC-Q200; series: CL; Size / Dimension: 0.079" L x 0.049" W (2.00mm x 1.25mm); Supplier 1: DigiKey; Supplier Part Number 1: 1276-6685-1-ND; Temperature Coefficient: X7S; Thickness (Max): 0.055" (1.40mm); value: 10 µF; Voltage - Rated: 10V; LCSC part #: C32635
IC1 = AS5600-ASOT: Hall Effect Sensor Angle External Magnet, Not Included Gull Wing; LSCS part #: C499458; MF: ams; SnapEDA_Link: https://www.snapeda.com/parts/AS5600-ASOT/ams/view-part/?ref=snap; Package: SOIC-8 ams; Value: *; MP: AS5600-ASOT; Check_prices: https://www.snapeda.com/parts/AS5600-ASOT/ams/view-part/?ref=eda; LCSC part #: C499458
R11 = CPF0805B10KE: as R1 on sheet MCU; Part Number: CPF0805B10KE; Value: 10 kOhms; ComponentLink1Description: Datasheet; ComponentLink1URL: https://www.te.com/commerce/DocumentDelivery/DDEController?Action=srchrtrv&DocNm=1773200&DocType=DS&DocLang=English; ComponentLink2Description: DigiKey Link; ComponentLink2URL: https://www.digikey.com/en/products/detail/te-connectivity-passive-product/CPF0805B10KE/2389790; Composition: Thin Film; Device Package: 0805 (2012 Metric); Height - Seated (Max): 0.026" (0.65mm); LastUpdated: 4/5/2026 8:11:26 PM; Lifecycle Status: Active; Minimum Order: 1; Number of Terminations: 2; Operating Temperature: -55°C ~ 155°C; Package / Case: 0805 (2012 Metric); Packaging: TapeAndReel; PartId: 27724; Part Status: Active; Price: 0.09; Resistance: 10 kOhms; Series: CPF, Neohm; Size / Dimension: 0.079" L x 0.049" W (2.00mm x 1.25mm); Supplier 1: DigiKey; Supplier Part Number 1: A106043CT-ND; Supplier Device Package: 0805; Tolerance: ±0.1%; LCSC part #: C84376
R12 = TC33X-2-103E: TRIMMER 10K OHM 0.15W J LEAD TOP; Manufacturer: Bourns Inc.; Adjustment Type: Top Adjustment; Number of Turns: 1.0; Resistive Material: Cermet; Temperature Coefficient: ±250ppm/°C; Tolerance: ±25%; Part Number: TC33X-2-103E; ComponentLink1Description: Datasheet; ComponentLink1URL: https://www.bourns.com/docs/Product-Datasheets/TC33.pdf; ComponentLink2Description: DigiKey Link; ComponentLink2URL: https://www.digikey.com/en/products/detail/bourns-inc/TC33X-2-103E/612858; LastUpdated: 4/5/2026 8:40:53 PM; Lifecycle Status: Active; Minimum Order: 1; Mounting Type: Surface Mount; Packaging: TapeAndReel; PartId: 8; Part Status: Active; Power (Watts): 0.15W; Price: 0.11; Resistance: 10 kOhms; Series: Trimpot® TC33 - Open Frame; Size / Dimension: Rectangular - 0.150" x 0.142" Face (3.80mm x 3.60mm); Supplier 1: DigiKey; Supplier Part Number 1: TC33X-103ECT-ND; Termination Style: J Lead; Value: 10 kOhms; LCSC part #: C719176
R13 = RCS0805100KFKEA: RES SMD 100K OHM 1% 1/2W 0805; Manufacturer: Vishay Dale; Power (Watts): 0.5W, 1/2W; Temperature Coefficient: ±100ppm/°C; Part Number: RCS0805100KFKEA; Value: 100 kOhms; ComponentLink1Description: Datasheet; ComponentLink1URL: http://www.vishay.com/docs/20065/rcse3.pdf; ComponentLink2Description: DigiKey Link; ComponentLink2URL: https://www.digikey.com/en/products/detail/vishay-dale/RCS0805100KFKEA/5866996; Composition: Thick Film; Device Package: 0805 (2012 Metric); Features: Automotive AEC-Q200, Pulse Withstanding; Height - Seated (Max): 0.020" (0.50mm); LastUpdated: 4/5/2026 8:11:26 PM; Lifecycle Status: Active; Minimum Order: 1; Number of Terminations: 2; Operating Temperature: -55°C ~ 155°C; Package / Case: 0805 (2012 Metric); Packaging: TapeAndReel; PartId: 27789; Part Status: Active; Price: 0.02; Ratings: AEC-Q200; Resistance: 100 kOhms; Series: RCS e3; Size / Dimension: 0.079" L x 0.049" W (2.00mm x 1.25mm); Supplier 1: DigiKey; Supplier Part Number 1: 541-2850-1-ND; Supplier Device Package: 0805; Tolerance: ±1%; LCSC part #: C122537
R14 R15 = KRL1632E-M-R120-F-T5: RES 0.12 OHM 1% 3/4W 1206; Manufacturer: Susumu; Power (Watts): 0.75W, 3/4W; Temperature Coefficient: ±50ppm/°C; Part Number: KRL1632E-M-R120-F-T5; ComponentLink1Description: Datasheet; ComponentLink1URL: http://www.susumu.co.jp/common/pdf/n_catalog_partition09_en.pdf; ComponentLink2Description: DigiKey Link; ComponentLink2URL: https://www.digikey.com/en/products/detail/susumu/KRL1632E-M-R120-F-T5/3738009; Composition: Metal Foil; Device Package: 1206 (3216 Metric); Features: Automotive AEC-Q200, Current Sense; Height - Seated (Max): 0.028" (0.70mm); LastUpdated: 4/6/2026 8:00:54 PM; Lifecycle Status: Active; Minimum Order: 1; Number of Terminations: 2; Operating Temperature: -55°C ~ 155°C; Package / Case: 1206 (3216 Metric); Packaging: TapeAndReel; PartId: 26840; Part Status: Active; Price: 0.09; Ratings: AEC-Q200; Resistance: 120 mOhms; Series: KRL; Size / Dimension: 0.126" L x 0.063" W (3.20mm x 1.60mm); Supplier 1: DigiKey; Supplier Part Number 1: 408-1583-1-ND; Supplier Device Package: 1206; Tolerance: ±1%; Value: 120 mOhms; LCSC part #: C6356569
R16 R17 = RCS08054K70JNEA: RES SMD 4.7K OHM 5% 1/2W 0805; Manufacturer: Vishay Dale; Power (Watts): 0.5W, 1/2W; Temperature Coefficient: ±200ppm/°C; Part Number: RCS08054K70JNEA; Value: 4.7 kOhms; ComponentLink1Description: Datasheet; ComponentLink1URL: http://www.vishay.com/docs/20065/rcse3.pdf; ComponentLink2Description: DigiKey Link; ComponentLink2URL: https://www.digikey.com/en/products/detail/vishay-dale/RCS08054K70JNEA/5867012; Composition: Thick Film; Device Package: 0805 (2012 Metric); Features: Automotive AEC-Q200, Pulse Withstanding; Height - Seated (Max): 0.020" (0.50mm); LastUpdated: 4/5/2026 8:11:26 PM; Lifecycle Status: Active; Minimum Order: 1; Number of Terminations: 2; Operating Temperature: -55°C ~ 155°C; Package / Case: 0805 (2012 Metric); Packaging: TapeAndReel; PartId: 27839; Part Status: Active; Price: 0.02; Ratings: AEC-Q200; Resistance: 4.7 kOhms; Series: RCS e3; Size / Dimension: 0.079" L x 0.049" W (2.00mm x 1.25mm); Supplier 1: DigiKey; Supplier Part Number 1: 541-2866-1-ND; Supplier Device Package: 0805; Tolerance: ±5%; LCSC part #: C865532
R18 = RNCS0805BKE1K00: RES 1K OHM 0.1% 1/10W 0805; Manufacturer: Stackpole Electronics Inc; Power (Watts): 0.1W, 1/10W; Temperature Coefficient: ±25ppm/°C; Part Number: RNCS0805BKE1K00; Value: 1 kOhms; ComponentLink1Description: Datasheet; ComponentLink1URL: https://www.seielect.com/catalog/sei-rncs_rnch.pdf; ComponentLink2Description: DigiKey Link; ComponentLink2URL: https://www.digikey.com/en/products/detail/stackpole-electronics-inc/RNCS0805BKE1K00/1800073; Composition: Thin Film; Device Package: 0805 (2012 Metric); Features: Anti-Corrosive, Automotive AEC-Q200, Moisture Resistant; Height - Seated (Max): 0.026" (0.65mm); LastUpdated: 4/5/2026 8:11:26 PM; Lifecycle Status: Active; Minimum Order: 1; Number of Terminations: 2; Operating Temperature: -55°C ~ 155°C; Package / Case: 0805 (2012 Metric); Packaging: TapeAndReel; PartId: 27715; Part Status: Active; Price: 0.08; Ratings: AEC-Q200; Resistance: 1 kOhms; Series: RNCS; Size / Dimension: 0.079" L x 0.049" W (2.00mm x 1.25mm); Supplier 1: DigiKey; Supplier Part Number 1: RNCS0805BKE1K00CT-ND; Supplier Device Package: 0805; Tolerance: ±0.1%; LCSC part #: C441981
U4 = TMC2209-LA-T: Bipolar Motor Driver Power MOSFET Step/Direction, UART 28-QFN (5x5); MF: Trinamic Motion Control GmbH; SnapEDA_Link: https://www.snapeda.com/parts/TMC2209-LA-T/Trinamic/view-part/?ref=snap; Package: VFQFN-28 Trinamic; Value: *; MP: TMC2209-LA-T; Check_prices: https://www.snapeda.com/parts/TMC2209-LA-T/Trinamic/view-part/?ref=eda; LCSC part #: C2150710
J5 = S4B-XH-A: Package: None; Price: None; Value: *; MP: S4B-XH-A; Availability: Unavailable; LCSC part #: C19271397

## Sheet CAN.SchDoc
size A; SheetNumber: 4; SheetTotal: 4
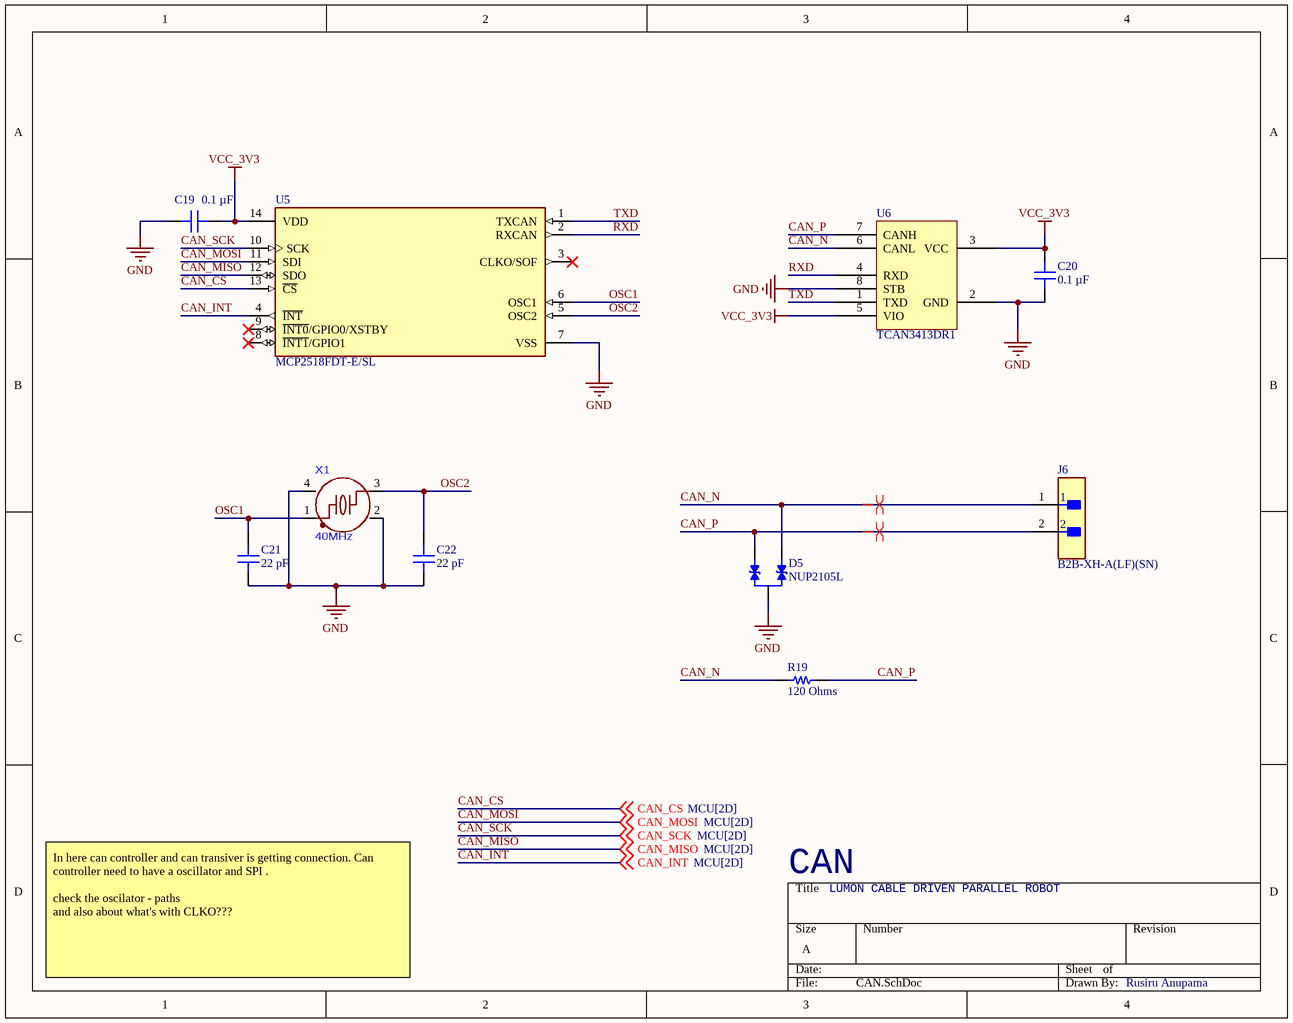
[diagram p3: CAN.SchDoc]

### Parts
C19  0.1 µF  [CAP 0805_2012]
C20  0.1 µF  [CAP 0805_2012]
C21  22 pF  [CAP 0805_2012]
C22  22 pF  [CAP 0805_2012]
D5  NUP2105L  [SOT95P240X120-3N]
J6  B2B-XH-A(LF)(SN)  [FP-B2B-XH-A_LF_SN-MFG]
R19  120 Ohms  [RES 0805_2012]
U5  MCP2518FDT-E/SL  [FP-C04-065-SL-IPC_A]
U6  TCAN3413DR1  [TCAN3413DR1]
X1  40MHz  [CRYSTAL-SMD_4P-L3.2-W2.5-BL]

### Nets
GND: C19.1 C20.1 C21.1 C22.1 D5.3 U5.7(VSS) U6.2(GND) U6.8(STB) X1.2(GND) X1.4(GND)
VCC_3V3: C19.2 C20.2 U5.14(VDD) U6.3(VCC) U6.5(VIO)
CAN_CS: U5.13(~{CS}) ; off-sheet CAN_CS
CAN_INT: U5.4(~{INT}) ; off-sheet CAN_INT
CAN_MISO: U5.12(SDO) ; off-sheet CAN_MISO
CAN_MOSI: U5.11(SDI) ; off-sheet CAN_MOSI
CAN_N: D5.1 J6.1 R19.1 U6.6(CANL)
CAN_P: D5.2 J6.2 R19.2 U6.7(CANH)
CAN_SCK: U5.10(SCK) ; off-sheet CAN_SCK
OSC1: C21.2 U5.6(OSC1) X1.1
OSC2: C22.2 U5.5(OSC2) X1.3
RXD: U5.2(RXCAN) U6.4(RXD)
TXD: U5.1(TXCAN) U6.1(TXD)

Not connected (* = marked no-connect by the designer): U5 3(CLKO/SOF)* 8(~{INT1}/GPIO1)* 9(~{INT0}/GPIO0/XSTBY)*

### Layout directives
differential pair: CAN_N, CAN_P

### Notes on the sheet
- CAN
- LUMON CABLE DRIVEN PARALLEL ROBOT
- In here can controller and can transiver is getting connection. Can controller need to have a oscillator and SPI .
  check the oscilator - paths
  and also about what's with CLKO???
- Rusiru Anupama

### Library data of the parts
C19 C20 = CC0805MRX7R9BB104: as C1 on sheet MCU; Part Number: CC0805MRX7R9BB104; Capacitance: 0.1 µF; Applications: General Purpose; componentlink1description: Datasheet; componentlink1url: https://www.yageo.com/upload/media/product/productsearch/datasheet/mlcc/UPY-GPHC_X7R_6.3V-to-50V_18.pdf; componentlink2description: DigiKey Link; componentlink2url: https://www.digikey.com/en/products/detail/yageo/CC0805MRX7R9BB104/5884281; Device Package: 0805 (2012 Metric); lastupdated: 4/6/2026 7:33:19 PM; Lifecycle Status: Active; Minimum Order: 1; Mounting Type: Surface Mount, MLCC; Operating Temperature: -55°C ~ 125°C; Package / Case: 0805 (2012 Metric); packaging: TapeAndReel; partid: 2475; Part Status: Active; price: 0.01; series: CC; Size / Dimension: 0.079" L x 0.049" W (2.00mm x 1.25mm); Supplier 1: DigiKey; Supplier Part Number 1: 311-4351-1-ND; Temperature Coefficient: X7R; Thickness (Max): 0.037" (0.95mm); value: 0.1 µF; Voltage - Rated: 50V; LCSC part #: C49678; Parameter 1: *
C21 C22 = 885012007012: CAP CER 22PF 16V C0G/NP0 0805; manufacturer: Würth Elektronik; Temperature Coefficient: C0G, NP0; Tolerance: ±5%; Part Number: 885012007012; Capacitance: 22 pF; Applications: General Purpose; componentlink1description: Datasheet; componentlink1url: https://katalog.we-online.de/pbs/datasheet/885012007012.pdf; componentlink2description: DigiKey Link; componentlink2url: https://www.digikey.com/en/products/detail/würth-elektronik/885012007012/5453671; Device Package: 0805 (2012 Metric); lastupdated: 4/6/2026 7:32:47 PM; Lifecycle Status: Active; Minimum Order: 1; Mounting Type: Surface Mount, MLCC; Operating Temperature: -55°C ~ 125°C; Package / Case: 0805 (2012 Metric); packaging: TapeAndReel; partid: 11782; Part Status: Active; price: 0.03; series: WCAP-CSGP; Size / Dimension: 0.079" L x 0.049" W (2.00mm x 1.25mm); Supplier 1: DigiKey; Supplier Part Number 1: 732-7816-1-ND; Thickness (Max): 0.028" (0.70mm); value: 22 pF; Voltage - Rated: 16V; LCSC part #: C1804
D5 = NUP2105L: ESD, SOT-23, 0.1ÂµA, 24V, Unidir; MF: Diotec Semiconductor; SnapEDA_Link: https://www.snapeda.com/parts/NUP2105L/Diotec/view-part/?ref=snap; Package: SOT-23 Diotec; Value: *; MP: NUP2105L; Check_prices: https://www.snapeda.com/parts/NUP2105L/Diotec/view-part/?ref=eda; LCSC part #: C14486
J6 = CMP-2000-05888-3: CONN HEADER VERT 2POS 2.5MM; Current Rating: 3A; Voltage Rating: 250V; Number of Contacts: 2; Contact Resistance: 20mR; Wire/Cable Gauge: 22AWG; Insulation Resistance: 1GR; Connector Type: Male Pin; Packaging: Bulk; Contact Material: Brass; Lead Free: Lead Free; Orientation: Straight; Contact Plating: Tin; Max Current Rating: 3A; Termination: Solder; Fastening Type: Detent; Depth: 5.75mm; Housing Material: Polyamide; REACH SVHC: No SVHC; Series: XH; Voltage Rating (AC): 250V; Number of Positions: 2; Color: Natural; Contact Type: Male Pin; Max Voltage Rating (DC): 250V; Pitch: 2.5mm; Lead Pitch: 2.5mm; Mount: Through Hole; Max Operating Temperature: 85°C; Length: 7.4mm; Max Voltage Rating (AC): 250V; Min Operating Temperature: -25°C; Number of Rows: 1; Housing Color: White; LCSC part #: C19271386
R19 = CRCW0805120RFKEAHP: RES SMD 120 OHM 1% 1/2W 0805; Manufacturer: Vishay Dale; Power (Watts): 0.5W, 1/2W; Temperature Coefficient: ±100ppm/°C; Part Number: CRCW0805120RFKEAHP; Value: 120 Ohms; ComponentLink1Description: Datasheet; ComponentLink1URL: http://www.vishay.com/docs/20043/crcwhpe3.pdf; ComponentLink2Description: DigiKey Link; ComponentLink2URL: https://www.digikey.com/en/products/detail/vishay-dale/CRCW0805120RFKEAHP/2226864; Composition: Thick Film; Device Package: 0805 (2012 Metric); Features: Automotive AEC-Q200, Pulse Withstanding; Height - Seated (Max): 0.024" (0.60mm); LastUpdated: 4/5/2026 8:11:15 PM; Lifecycle Status: Active; Minimum Order: 1; Number of Terminations: 2; Operating Temperature: -55°C ~ 155°C; Package / Case: 0805 (2012 Metric); Packaging: TapeAndReel; PartId: 30328; Part Status: Active; Price: 0.02; Ratings: AEC-Q200; Resistance: 120 Ohms; Series: CRCW-HP e3; Size / Dimension: 0.079" L x 0.049" W (2.00mm x 1.25mm); Supplier 1: DigiKey; Supplier Part Number 1: 541-120TCT-ND; Supplier Device Package: 0805; Tolerance: ±1%; LCSC part #: C410053
U5 = CMP-06298-000019-1: IC CAN CONTROLLER SPI 14SOIC; RoHS Compliant: Yes; LCSC part #: C626758
X1 = XL2EL89CPI-111YLC-40M: LCSC part #: C5444549
U6 = TCAN3413DR1: LCSC part #: C22396693

## Nets that join several sheets
GND: MCU (22 pins), Power (8 pins), MotorDriver (18 pins), CAN (10 pins)
VCC_3V3: MCU (8 pins), Power (C9.2 D4.1 U3.3), MotorDriver (9 pins), CAN (5 pins)
VS: Power (C7.1 J7.3), MotorDriver (6 pins)
AS5600_OUT: MCU (U1.13), MotorDriver (IC1.3)
AS5600_SDA: MCU (U1.12), MotorDriver (IC1.6 R16.1)
AS5600_SDL: MCU (U1.17), MotorDriver (IC1.7 R17.1)
CAN_CS: MCU (U1.18), CAN (U5.13)
CAN_INT: MCU (U1.22), CAN (U5.4)
CAN_MISO: MCU (U1.21), CAN (U5.12)
CAN_MOSI: MCU (U1.19), CAN (U5.11)
CAN_SCK: MCU (U1.20), CAN (U5.10)
PD_UART: MCU (U1.11), MotorDriver (R18.1 U4.14)
TMC2209_DIAG: MCU (U1.8), MotorDriver (U4.11)
TMC2209_DIR: MCU (U1.4), MotorDriver (U4.19)
TMC2209_ENN: MCU (U1.14), MotorDriver (U4.2)
TMC2209_MS1: MCU (U1.9), MotorDriver (U4.9)
TMC2209_MS2: MCU (U1.7), MotorDriver (U4.10)
TMC2209_STEP: MCU (U1.5), MotorDriver (U4.16)
TMC2209_TXD: MCU (U1.10), MotorDriver (R18.2)